# Altium schematic sheet MainDout.SchDoc
size A4
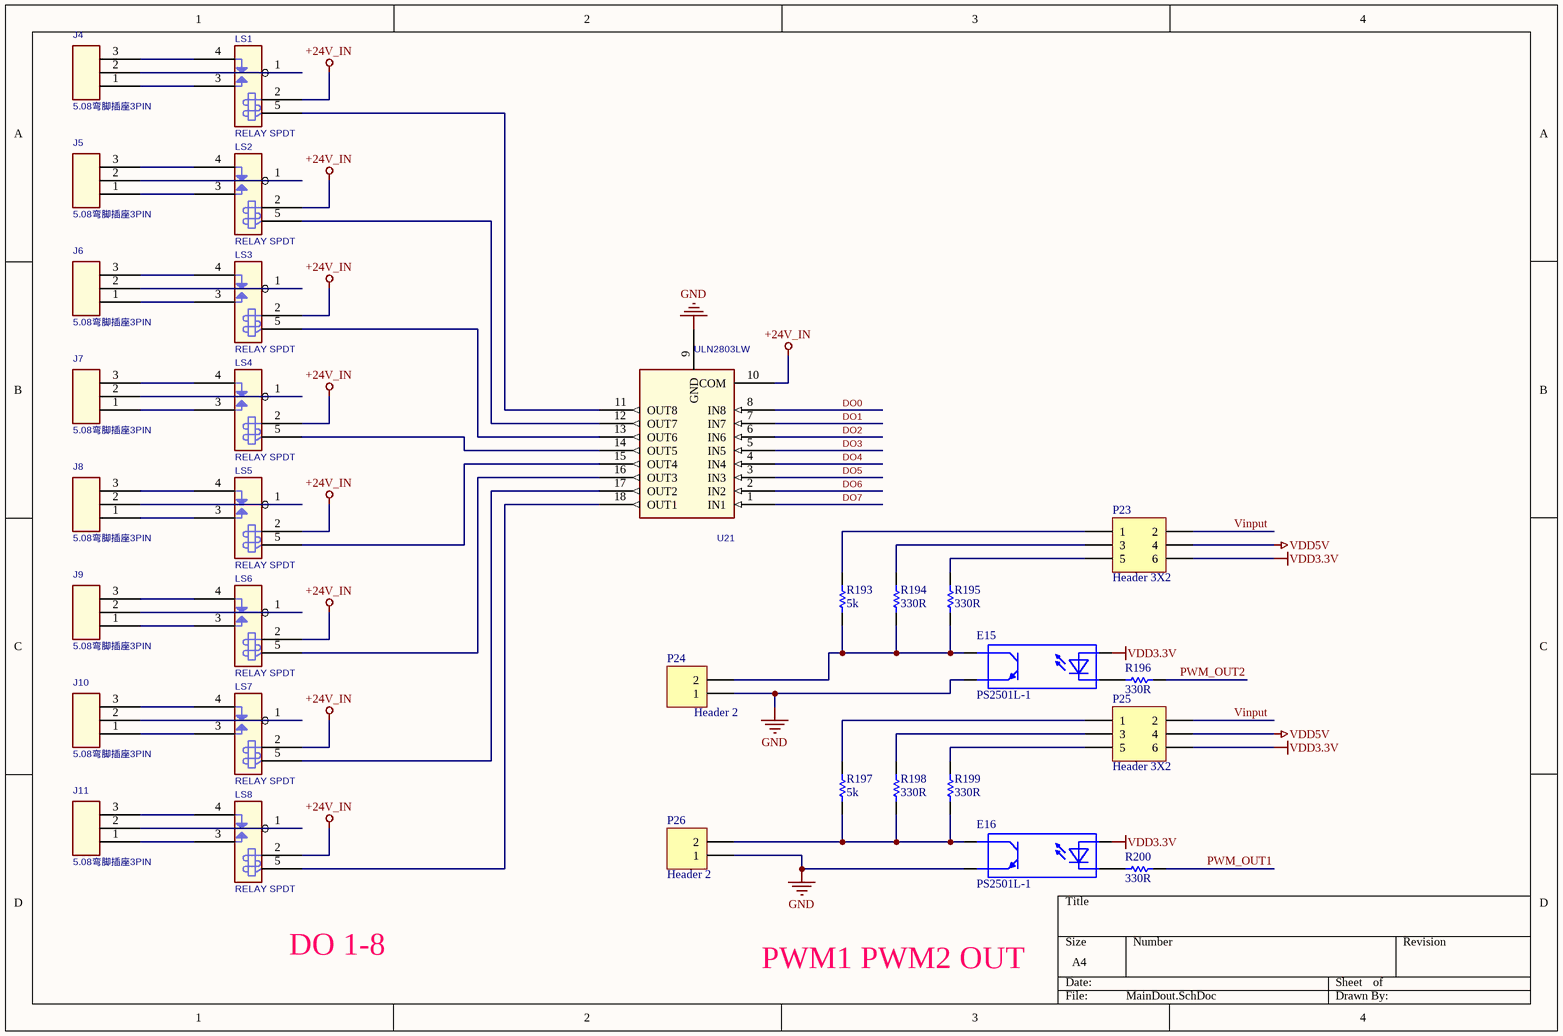
[diagram p0: MainDout.SchDoc]

## Parts
E15  PS2501L-1  [NEC2501]
E16  PS2501L-1  [NEC2501]
J4  5.08弯脚插座3PIN  [JIEKE_3PX508]
J5  5.08弯脚插座3PIN  [JIEKE_3PX508]
J6  5.08弯脚插座3PIN  [JIEKE_3PX508]
J7  5.08弯脚插座3PIN  [JIEKE_3PX508]
J8  5.08弯脚插座3PIN  [JIEKE_3PX508]
J9  5.08弯脚插座3PIN  [JIEKE_3PX508]
J10  5.08弯脚插座3PIN  [JIEKE_3PX508]
J11  5.08弯脚插座3PIN  [JIEKE_3PX508]
LS1  RELAY SPDT  [RELAY_OMRON_G5LE-14]
LS2  RELAY SPDT  [RELAY_OMRON_G5LE-14]
LS3  RELAY SPDT  [RELAY_OMRON_G5LE-14]
LS4  RELAY SPDT  [RELAY_OMRON_G5LE-14]
LS5  RELAY SPDT  [RELAY_OMRON_G5LE-14]
LS6  RELAY SPDT  [RELAY_OMRON_G5LE-14]
LS7  RELAY SPDT  [RELAY_OMRON_G5LE-14]
LS8  RELAY SPDT  [RELAY_OMRON_G5LE-14]
P23  Header 3X2  [HDR2X3]
P24  Header 2  [JIEKE_2PX508]
P25  Header 3X2  [HDR2X3]
P26  Header 2  [JIEKE_2PX508]
R193  value 5k  [0805]  (hidden comment: Res Semi)
R194  value 330R  [0805]  (hidden comment: Res Semi)
R195  value 330R  [0805]  (hidden comment: Res Semi)
R196  value 330R  [0805]  (hidden comment: Res Semi)
R197  value 5k  [0805]  (hidden comment: Res Semi)
R198  value 330R  [0805]  (hidden comment: Res Semi)
R199  value 330R  [0805]  (hidden comment: Res Semi)
R200  value 330R  [0805]  (hidden comment: Res Semi)
U21  ULN2803LW  [SO18WN]

## Nets
+24V_IN: LS1.2(COIL2) LS2.2(COIL2) LS3.2(COIL2) LS4.2(COIL2) LS5.2(COIL2) LS6.2(COIL2) LS7.2(COIL2) LS8.2(COIL2) U21.10(COM)
GND: E15.3 E16.3 P24.1 P26.1 U21.9(GND)
VDD3.3V: E15.1 E16.1 P23.6 P25.6
VDD5V: P23.4 P25.4
DO0: U21.8(IN8)
DO1: U21.7(IN7)
DO2: U21.6(IN6)
DO3: U21.5(IN5)
DO4: U21.4(IN4)
DO5: U21.3(IN3)
DO6: U21.2(IN2)
DO7: U21.1(IN1)
PWM_OUT1: R200.2
PWM_OUT2: R196.2
Vinput: P23.2 P25.2
NetE15_2: E15.2 R196.1
NetE15_4: E15.4 P24.2 R193.2 R194.2 R195.2
NetE16_2: E16.2 R200.1
NetE16_4: E16.4 P26.2 R197.2 R198.2 R199.2
NetJ4_1: J4.1 LS1.3(NO)
NetJ4_2: J4.2 LS1.1(COMMON)
NetJ4_3: J4.3 LS1.4(NC)
NetJ5_1: J5.1 LS2.3(NO)
NetJ5_2: J5.2 LS2.1(COMMON)
NetJ5_3: J5.3 LS2.4(NC)
NetJ6_1: J6.1 LS3.3(NO)
NetJ6_2: J6.2 LS3.1(COMMON)
NetJ6_3: J6.3 LS3.4(NC)
NetJ7_1: J7.1 LS4.3(NO)
NetJ7_2: J7.2 LS4.1(COMMON)
NetJ7_3: J7.3 LS4.4(NC)
NetJ8_1: J8.1 LS5.3(NO)
NetJ8_2: J8.2 LS5.1(COMMON)
NetJ8_3: J8.3 LS5.4(NC)
NetJ9_1: J9.1 LS6.3(NO)
NetJ9_2: J9.2 LS6.1(COMMON)
NetJ9_3: J9.3 LS6.4(NC)
NetJ10_1: J10.1 LS7.3(NO)
NetJ10_2: J10.2 LS7.1(COMMON)
NetJ10_3: J10.3 LS7.4(NC)
NetJ11_1: J11.1 LS8.3(NO)
NetJ11_2: J11.2 LS8.1(COMMON)
NetJ11_3: J11.3 LS8.4(NC)
NetLS1_5: LS1.5(COIL1) U21.11(OUT8)
NetLS2_5: LS2.5(COIL1) U21.12(OUT7)
NetLS3_5: LS3.5(COIL1) U21.13(OUT6)
NetLS4_5: LS4.5(COIL1) U21.14(OUT5)
NetLS5_5: LS5.5(COIL1) U21.15(OUT4)
NetLS6_5: LS6.5(COIL1) U21.16(OUT3)
NetLS7_5: LS7.5(COIL1) U21.17(OUT2)
NetLS8_5: LS8.5(COIL1) U21.18(OUT1)
NetP23_1: P23.1 R193.1
NetP23_3: P23.3 R194.1
NetP23_5: P23.5 R195.1
NetP25_1: P25.1 R197.1
NetP25_3: P25.3 R198.1
NetP25_5: P25.5 R199.1

## Notes on the sheet
- DO 1-8
- PWM1 PWM2 OUT

## Library data of the parts
E15 E16 = OPTO: 光耦
J4-J11 = CON3: PCB Footprint SMD: 插件; TOLERANCE: =J57_TOLERANCE
LS1-LS8 = RELAY SPDT_1
P23 P25 = Header 3X2: Header, 3-Pin, Dual row; LatestRevisionDate: 17-Jul-2002; LatestRevisionNote: Re-released for DXP Platform.; Publisher: Altium Limited
P24 P26 = Header 2: Header, 2-Pin; LatestRevisionDate: 17-Jul-2002; LatestRevisionNote: Re-released for DXP Platform.; Publisher: Altium Limited
R193-R200 = Res Semi: Semiconductor Resistor; Published: 8-Jun-2000; LatestRevisionDate: 17-Jul-2002; LatestRevisionNote: Re-released for DXP Platform.; PackageReference: AXIAL-0.5; Publisher: Altium Limited
U21 = ULN2803: PCB Footprint SMD: SMD; TOLERANCE: =U21_TOLERANCE